# Altium schematic sheet FPGA_Bank_IO.SchDoc
size A4; SheetNumber: 2; SheetTotal: 8
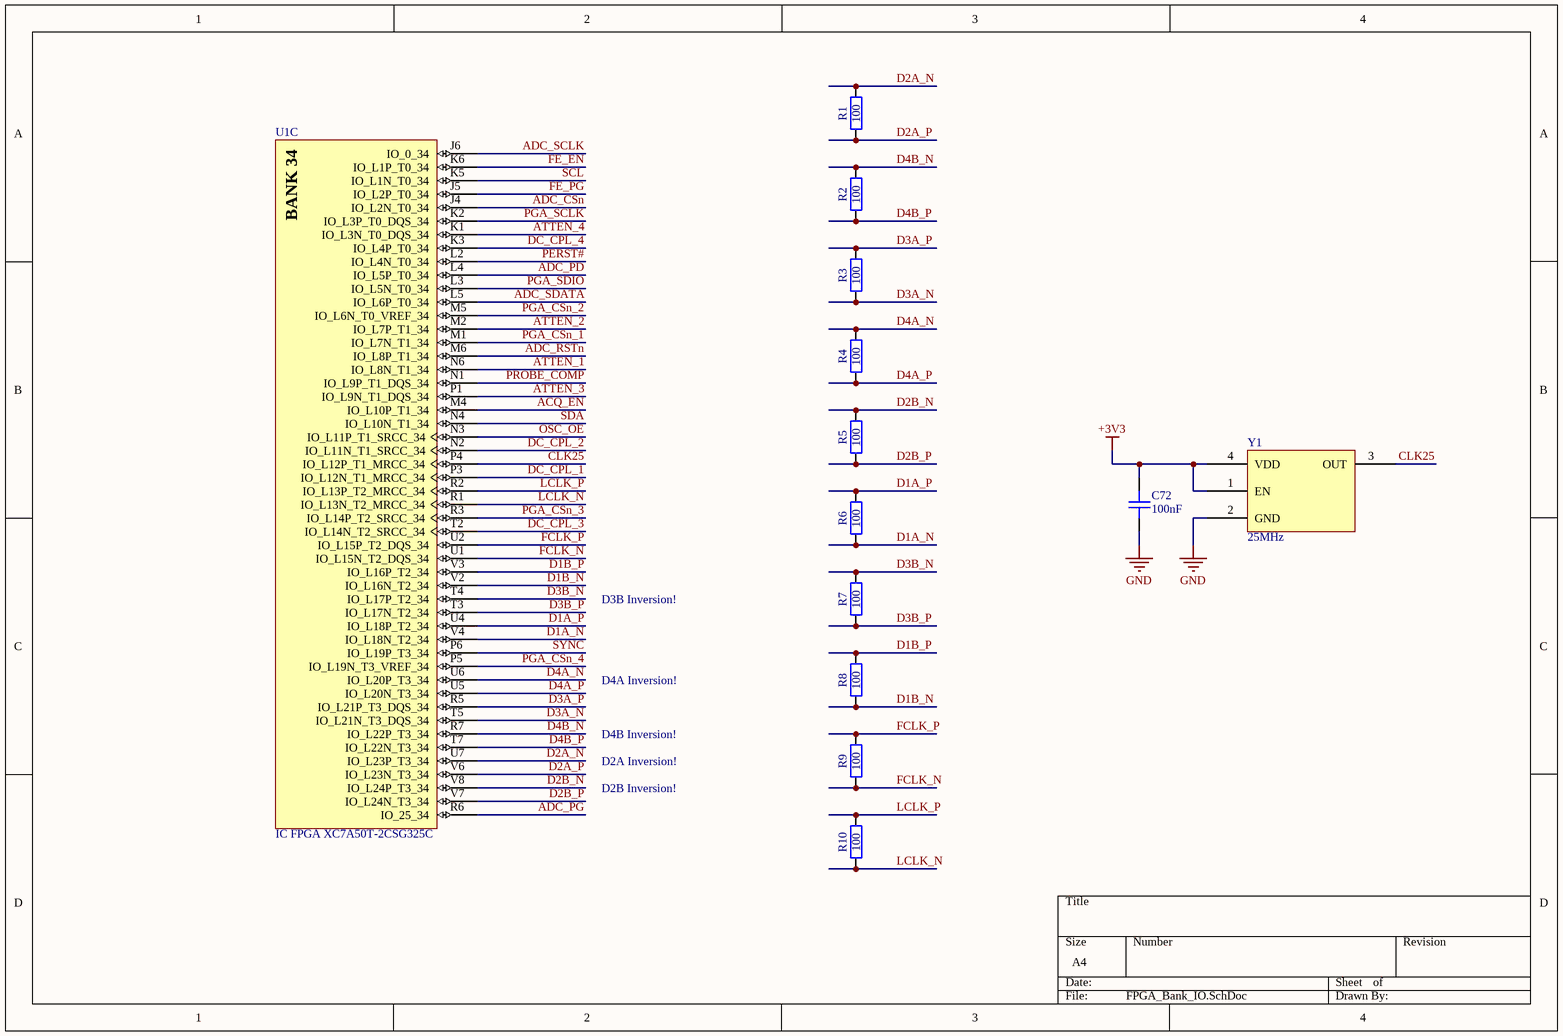
[diagram p0: FPGA_Bank_IO.SchDoc]

## Parts
C72  100nF  [GEN_C_0402]
R1  100  [GEN_R_0201]
R2  100  [GEN_R_0201]
R3  100  [GEN_R_0201]
R4  100  [GEN_R_0201]
R5  100  [GEN_R_0201]
R6  100  [GEN_R_0201]
R7  100  [GEN_R_0201]
R8  100  [GEN_R_0201]
R9  100  [GEN_R_0201]
R10  100  [GEN_R_0201]
U1  IC FPGA XC7A50T-2CSG325C  [XILINX_XC7A50T-2CSG325C]  (part C of 9)
Y1  25MHz  [ECS_TXO-2016]

## Nets
+3V3: C72.1 Y1.1(EN) Y1.4(VDD)
GND: C72.2 Y1.2(GND)
ACQ_EN: U1.M4(IO_L10P_T1_34)
ADC_CSn: U1.J4(IO_L2N_T0_34)
ADC_PD: U1.L4(IO_L5P_T0_34)
ADC_PG: U1.R6(IO_25_34)
ADC_RSTn: U1.M6(IO_L8P_T1_34)
ADC_SCLK: U1.J6(IO_0_34)
ADC_SDATA: U1.L5(IO_L6P_T0_34)
ATTEN_1: U1.N6(IO_L8N_T1_34)
ATTEN_2: U1.M2(IO_L7P_T1_34)
ATTEN_3: U1.P1(IO_L9N_T1_DQS_34)
ATTEN_4: U1.K1(IO_L3N_T0_DQS_34)
CLK25: U1.P4(IO_L12P_T1_MRCC_34) Y1.3(OUT)
D1A_N: R6.1 U1.V4(IO_L18N_T2_34)
D1A_P: R6.2 U1.U4(IO_L18P_T2_34)
D1B_N: R8.1 U1.V2(IO_L16N_T2_34)
D1B_P: R8.2 U1.V3(IO_L16P_T2_34)
D2A_N: R1.2 U1.U7(IO_L23P_T3_34)
D2A_P: R1.1 U1.V6(IO_L23N_T3_34)
D2B_N: R5.2 U1.V8(IO_L24P_T3_34)
D2B_P: R5.1 U1.V7(IO_L24N_T3_34)
D3A_N: R3.1 U1.T5(IO_L21N_T3_DQS_34)
D3A_P: R3.2 U1.R5(IO_L21P_T3_DQS_34)
D3B_N: R7.2 U1.T4(IO_L17P_T2_34)
D3B_P: R7.1 U1.T3(IO_L17N_T2_34)
D4A_N: R4.2 U1.U6(IO_L20P_T3_34)
D4A_P: R4.1 U1.U5(IO_L20N_T3_34)
D4B_N: R2.2 U1.R7(IO_L22P_T3_34)
D4B_P: R2.1 U1.T7(IO_L22N_T3_34)
DC_CPL_1: U1.P3(IO_L12N_T1_MRCC_34)
DC_CPL_2: U1.N2(IO_L11N_T1_SRCC_34)
DC_CPL_3: U1.T2(IO_L14N_T2_SRCC_34)
DC_CPL_4: U1.K3(IO_L4P_T0_34)
FCLK_N: R9.1 U1.U1(IO_L15N_T2_DQS_34)
FCLK_P: R9.2 U1.U2(IO_L15P_T2_DQS_34)
FE_EN: U1.K6(IO_L1P_T0_34)
FE_PG: U1.J5(IO_L2P_T0_34)
LCLK_N: R10.1 U1.R1(IO_L13N_T2_MRCC_34)
LCLK_P: R10.2 U1.R2(IO_L13P_T2_MRCC_34)
OSC_OE: U1.N3(IO_L11P_T1_SRCC_34)
PERST#: U1.L2(IO_L4N_T0_34)
PGA_CSn_1: U1.M1(IO_L7N_T1_34)
PGA_CSn_2: U1.M5(IO_L6N_T0_VREF_34)
PGA_CSn_3: U1.R3(IO_L14P_T2_SRCC_34)
PGA_CSn_4: U1.P5(IO_L19N_T3_VREF_34)
PGA_SCLK: U1.K2(IO_L3P_T0_DQS_34)
PGA_SDIO: U1.L3(IO_L5N_T0_34)
PROBE_COMP: U1.N1(IO_L9P_T1_DQS_34)
SCL: U1.K5(IO_L1N_T0_34)
SDA: U1.N4(IO_L10N_T1_34)
SYNC: U1.P6(IO_L19P_T3_34)

## Notes on the sheet
- D3B Inversion!
- D4A Inversion!
- D4B Inversion!
- D2B Inversion!
- D2A Inversion!
- (in symbol IC FPGA XC7A50T-2CSG325C, part C) BANK 34

## Library data of the parts
C72 = CAP 100nF 16V X7R 0402: Voltage Rating: 16V; Package: 0402; Supplier 1: Digi-Key; Supplier Part Number 1: 490-4759-1-ND; Value: 100nF
R1-R10 = RES 100 OHM 1% 1/20W 0201: Tolerance: 1%; Power Rating: 0.05W; Package: 0201; Value: 100; Supplier 1: Digi-Key; Supplier Part Number 1: 311-100MCT-ND
U1 = IC FPGA XC7A50T-2CSG325C: Artix-7 FPGA, 150 User I/Os, 4 GTP, 324-Ball BGA, Speed Grade 2, Commercial Grade, Pb-Free; Manufacturer: Xilinx; Total Block RAM: 1800 Kb; GTP: 4; Clock Mgmt Tiles (CMTs): 5; Logic Cells: 33280; Available User I/O: 150; Speed Grades: 2; NexusDeviceID: XC7A35T-2CSG325C; DatasheetVersion: v1.15; PackageVersion: Rev. 1.11; PackageReference: CSG-325; PackageDescription: 324-Ball Wire-Bond Chip-Scale BGA, Body 15 x 15 mm, Pitch 0.8 mm; Maximum Distributed RAM: 400 Kb; Operating Temperature Range: Commercial; Mounting Technology: Surface Mount; PartNumber: XC7A35T-2CSG325C; ComponentLink1Description: Manufacturer URL; ComponentLink1URL: http://www.xilinx.com/; ComponentLink2Description: Datasheet; ComponentLink2URL: http://www.xilinx.com/support/documentation/data_sheets/ds180_7Series_Overview.pdf; ComponentLink3Description: Package Specification; ComponentLink3URL: http://www.xilinx.com/support/documentation/user_guides/ug475_7Series_Pkg_Pinout.pdf; ComponentLink4Description: DC and Switching Characteristics; ComponentLink4URL: http://www.xilinx.com/support/documentation/data_sheets/ds181_Artix_7_Data_Sheet.pdf; ComponentLink5Description: Package File; ComponentLink5URL: http://www.xilinx.com/support/packagefiles/a7packages/xc7a200tsbg484pkg.txt; ComponentLink6Description: Packaging and Pinout; ComponentLink6URL: http://www.xilinx.com/support/documentation/user_guides/ug475_7Series_Pkg_Pinout.pdf
Y1 = OSC 25MHz ECS-TXO-2016: Supplier 1: Digi-Key; Supplier Part Number 1: XC3163CT-ND